# EAGLE schematic supply_dual_v0.11.a0fac544 (EAGLE 7.7.0)
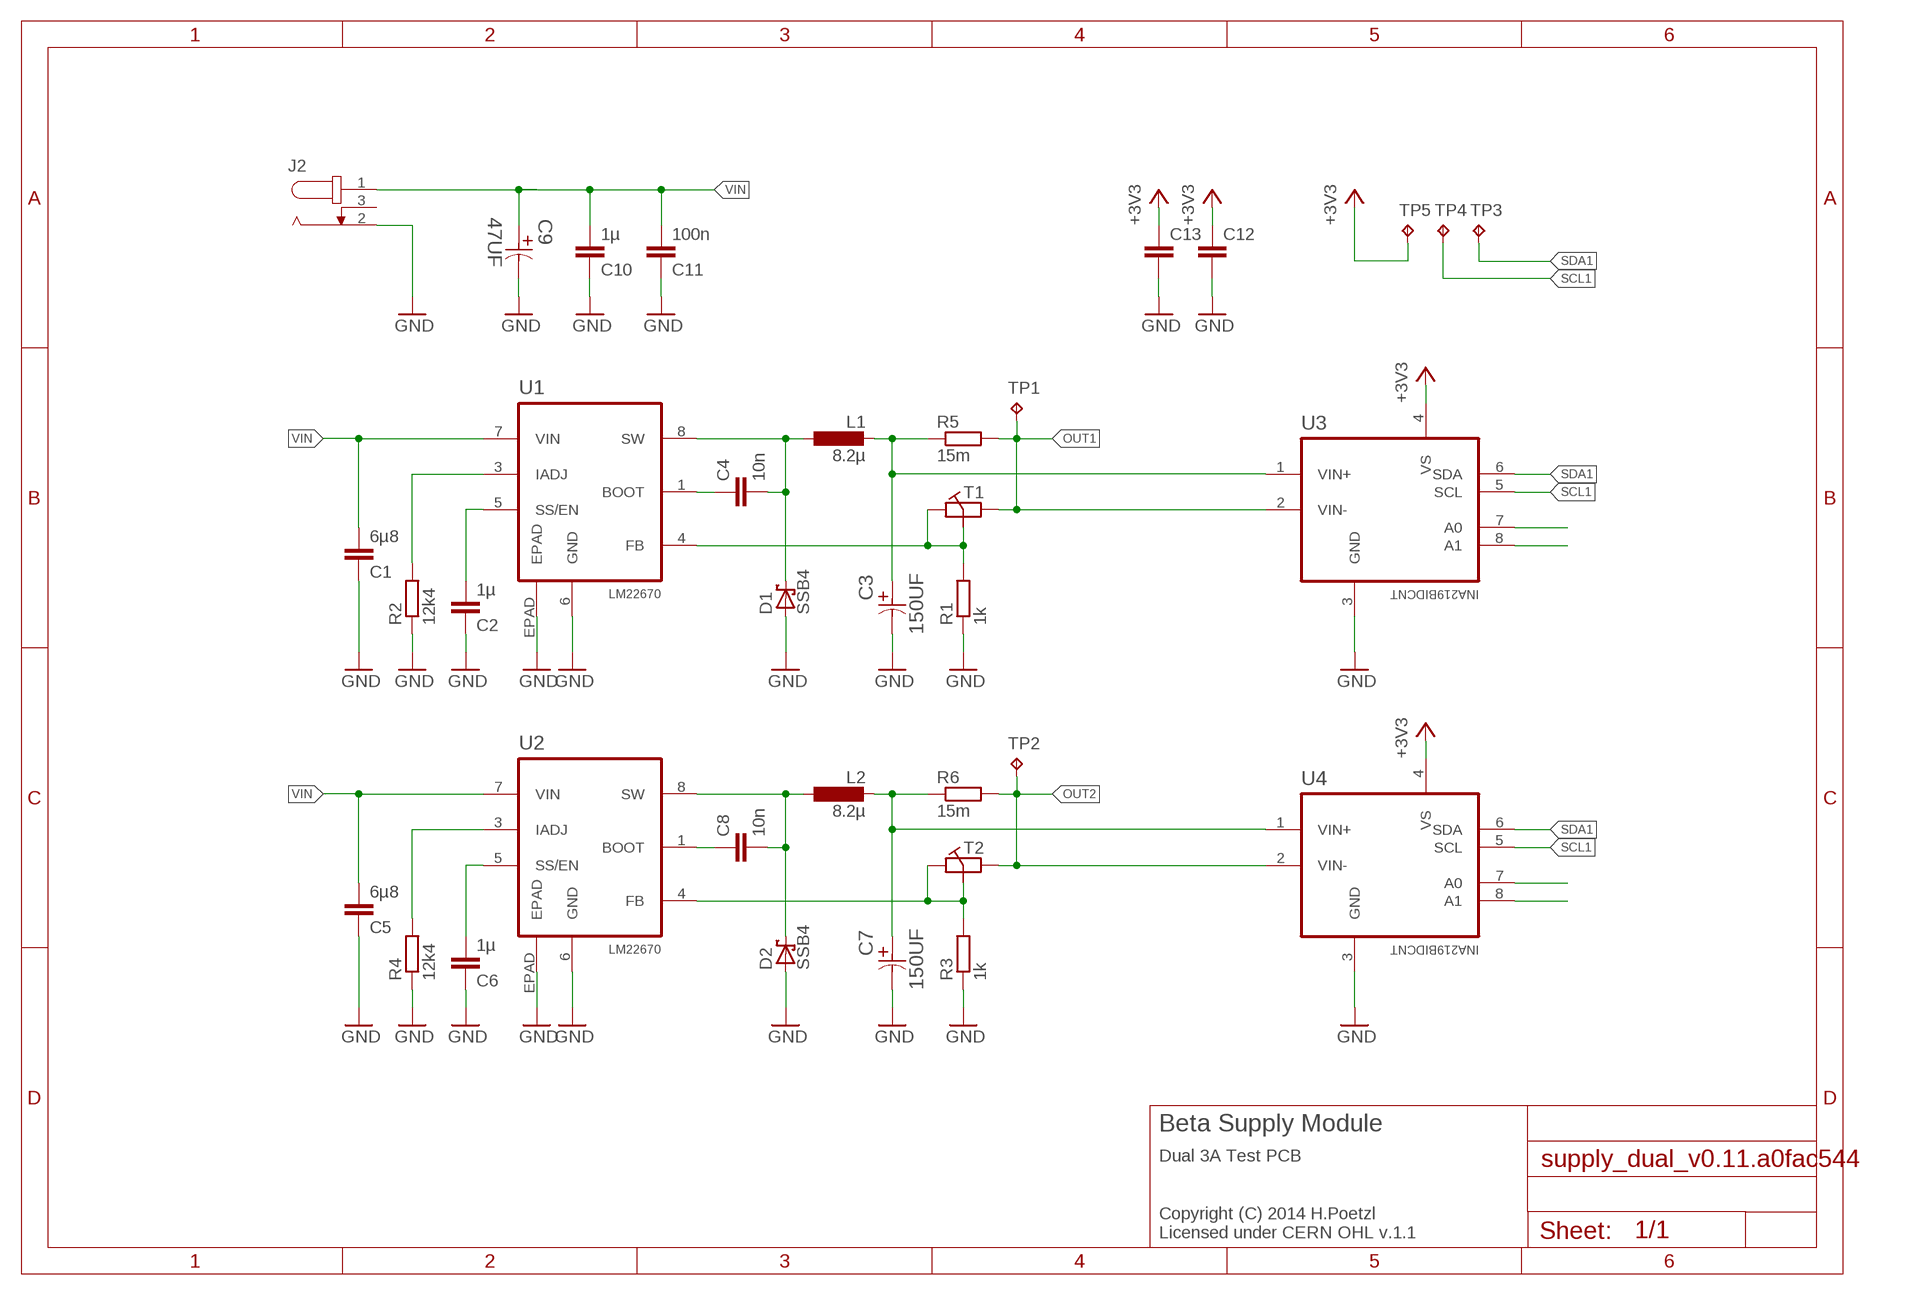
[diagram p0: schematic, sheet 1]

## Parts
C1  6µ8  C-EUC1210K  [C1210K]
C2  1µ  C-EUC0603K  [C0603K]
C3  150UF  EEFCX0J151R  [CAPT7343X430N]
C4  10n  C-EUC0603K  [C0603K]
C5  6µ8  C-EUC1210K  [C1210K]
C6  1µ  C-EUC0603K  [C0603K]
C7  150UF  EEFCX0J151R  [CAPT7343X430N]
C8  10n  C-EUC0603K  [C0603K]
C9  47UF  EEE-FT1H470AP-CASE-D  [CAPAE660X610N]
C10  1µ  C-EUC0805K  [C0805K]
C11  100n  C-EUC0603K  [C0603K]
C12  C-EUC0402K  [C0402K]
C13  C-EUC0402K  [C0402K]
D1  SSB4  [DO-214AA]
D2  SSB4  [DO-214AA]
J2  JACK-PLUGDC12  [FC681485]
L1  8.2µ  L-EUXAL50X0  [XAL50X0]
L2  8.2µ  L-EUXAL50X0  [XAL50X0]
R1  1k  R-EU_R0402  [R0402]
R2  12k4  R-EU_R0402  [R0402]
R3  1k  R-EU_R0402  [R0402]
R4  12k4  R-EU_R0402  [R0402]
R5  15m  R-EU_R1210  [R1210]
R6  15m  R-EU_R1210  [R1210]
T1  PVZ2A  [TRIM-PVZ2A]
T2  PVZ2A  [TRIM-PVZ2A]
TP1  TPB1,27  [B1,27]
TP2  TPB1,27  [B1,27]
TP3  TPB1,27  [B1,27]
TP4  TPB1,27  [B1,27]
TP5  TPB1,27  [B1,27]
U1  LM22670  LM2267_123  [DDA0008B]
U2  LM22670  LM2267_123  [DDA0008B]
U3  INA219BIDCNT  [SOT65P280X145-8N]
U4  INA219BIDCNT  [SOT65P280X145-8N]

## Nets
+3V3: C12.1 C13.1 TP5.TP U3.4(VS) U4.4(VS)
GND: C1.1 C2.1 C3.2 C5.1 C6.1 C7.2 C9.2 C10.1 C11.1 C12.2 C13.2 D1.A D2.A J2.2 R1.1 R2.1 R3.1 R4.1 U1.6(GND) U1.EPAD U2.6(GND) U2.EPAD U3.3(GND) U4.3(GND)
L1O: C3.1 L1.2 R5.1 U3.1(VIN+)
L1P: C4.2 D1.C L1.1 U1.8(SW)
L2O: C7.1 L2.2 R6.1 U4.1(VIN+)
L2P: C8.2 D2.C L2.1 U2.8(SW)
N$1: R1.2 T1.2(B) T1.3(C) U1.4(FB)
N$3: R3.2 T2.2(B) T2.3(C) U2.4(FB)
N$5: C8.1 U2.1(BOOT)
N$6: R4.2 U2.3(IADJ)
N$7: C6.2 U2.5(SS/EN)
N$8: U3.7(A0)
N$9: U3.8(A1)
N$10: C4.1 U1.1(BOOT)
N$12: R2.2 U1.3(IADJ)
N$13: C2.2 U1.5(SS/EN)
N$16: U4.7(A0)
N$17: U4.8(A1)
OUT1: R5.2 T1.1(A) TP1.TP U3.2(VIN-)
OUT2: R6.2 T2.1(A) TP2.TP U4.2(VIN-)
SCL1: TP4.TP U3.5(SCL) U4.5(SCL)
SDA1: TP3.TP U3.6(SDA) U4.6(SDA)
VIN: C1.2 C5.2 C9.1 C10.2 C11.2 J2.1 U1.7(VIN) U2.7(VIN)
Unconnected: J2.3

## Notes on the sheet
- Beta Supply Module
- Dual 3A Test PCB
- Copyright (C) 2014 H.Poetzl
  Licensed under CERN OHL v.1.1

## Library data of the parts
C1 C5 = rcl:C-EU: CAPACITOR, European symbol; OC_FARNELL: 1843171; REF_DESIGN: YES
C2 C6 C10 C11 = rcl:C-EU: CAPACITOR, European symbol; OC_FARNELL: 1759399
C3 C7 = Panasonic-EEF:EEF: SP-Cap/ Conductive Polymer Aluminum Capacitors (Specialty Polymer Aluminum Capacitors); MPN: EEFCX0J151R; OC_FARNELL: 1751912; OC_NEWARK: 54W2542; PACKAGE: 7343; SUPPLIER: PANASONIC; VOLTAGERATING: 6.3V
C4 C8 = rcl:C-EU: CAPACITOR, European symbol; OC_FARNELL: 1844133; REF_DESIGN: NO
C9 = Panasonic-EEEFT_EEEH:EEE-: Aluminum Electrolytic Capacitors,Surface Mount Type; MPN: EEE-FT1H470AP; OC_FARNELL: 1868425; OC_NEWARK: 31T8185; PACKAGE: CASE-D; SUPPLIER: PANASONIC; TOLERANCE: ±20 %; VOLTAGERATING: 50V
C12 C13 = rcl:C-EU: CAPACITOR, European symbol
D1 D2 = shottky:SSB4*; OC_FARNELL: 1336557
J2 = dc-jack:JACK-PLUG: DC POWER JACK Power Jack, DC, Right Angle, Through Hole, Rated 5A at 16VDC, PC Terminals Distributor: Farnell (www.Farnell.de) Drawing: 84N1161.pdf / 84N1162.pdf Manufacturer: SPC Technology (www.spctechnology.com) Type: SPC4077 / SPC 4078 http://www.cliffinc.com/products/dcconnectors/FC681485.pdf
L1 L2 = coilcraft:L-EU: INDUCTOR, European symbol
R1 R3 = rcl:R-EU_: RESISTOR, European symbol; OC_FARNELL: 2072516
R2 R4 = rcl:R-EU_: RESISTOR, European symbol; OC_FARNELL: 2072591
R5 R6 = rcl:R-EU_: RESISTOR, European symbol; OC_FARNELL: 2079441
T1 T2 = paul:PVZ2A
TP1-TP5 = testpad:TP: Test pad
U1 U2 = lm22670:LM2267_123: LM2267x X may be either the 1, 2, or 3 versions.; OC_FARNELL: 1679663
U3 U4 = ina219:INA219BIDCNT: CURRENT/POWER MONITOR with I2C Interface; MPN: INA219BIDCNT; OC_FARNELL: 1855125; OC_NEWARK: 12T2860; PACKAGE: SOT-23-8; SUPPLIER: TEXAS INSTRUMENTS